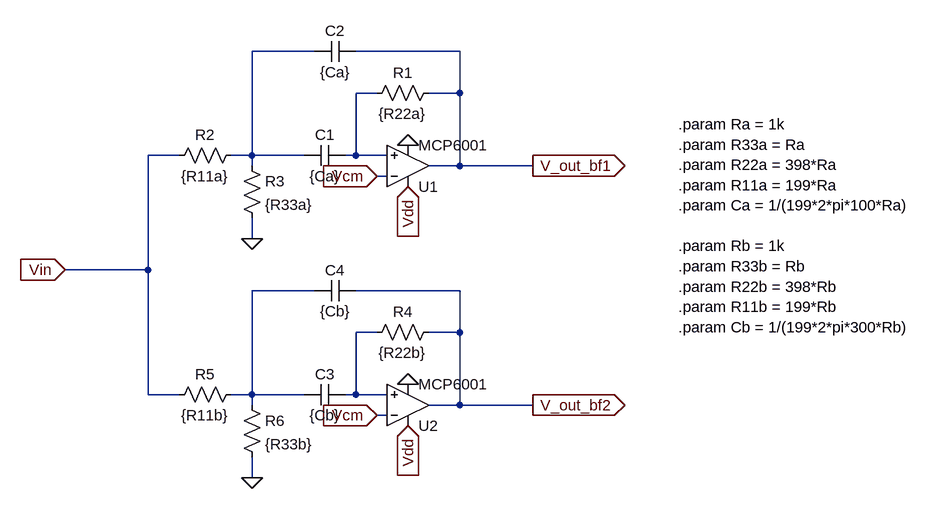
[diagram p0: schematic Draft21.asc]
Draft21.asc, the LTspice schematic file:
Version 4
SHEET 1 880 680
WIRE -64 -192 -160 -192
WIRE 160 -192 0 -192
WIRE 32 -128 0 -128
WIRE 160 -128 160 -192
WIRE 160 -128 112 -128
WIRE -272 -32 -320 -32
WIRE -160 -32 -160 -192
WIRE -160 -32 -192 -32
WIRE -80 -32 -160 -32
WIRE 0 -32 0 -128
WIRE 0 -32 -16 -32
WIRE 48 -32 0 -32
WIRE -160 -16 -160 -32
WIRE 160 -16 160 -128
WIRE 160 -16 112 -16
WIRE 272 -16 160 -16
WIRE 48 0 32 0
WIRE -160 96 -160 64
WIRE -320 144 -320 -32
WIRE -320 144 -448 144
WIRE -64 176 -160 176
WIRE 160 176 0 176
WIRE 32 240 0 240
WIRE 160 240 160 176
WIRE 160 240 112 240
WIRE -320 336 -320 144
WIRE -272 336 -320 336
WIRE -160 336 -160 176
WIRE -160 336 -192 336
WIRE -80 336 -160 336
WIRE 0 336 0 240
WIRE 0 336 -16 336
WIRE 48 336 0 336
WIRE -160 352 -160 336
WIRE 160 352 160 240
WIRE 160 352 112 352
WIRE 272 352 160 352
WIRE 48 368 32 368
WIRE -160 464 -160 432
FLAG 80 -48 0
FLAG 80 16 Vdd
IOPIN 80 16 In
FLAG -160 96 0
FLAG 80 320 0
FLAG 80 384 Vdd
IOPIN 80 384 In
FLAG -160 464 0
FLAG 272 -16 V_out_bf1
IOPIN 272 -16 Out
FLAG 272 352 V_out_bf2
IOPIN 272 352 Out
FLAG 32 368 Vcm
IOPIN 32 368 In
FLAG 32 0 Vcm
IOPIN 32 0 In
FLAG -448 144 Vin
IOPIN -448 144 In
SYMBOL MCP6001 80 -16 M180
SYMATTR InstName U1
SYMBOL cap -16 -16 M270
WINDOW 0 32 32 VTop 2
WINDOW 3 0 32 VBottom 2
SYMATTR InstName C1
SYMATTR Value {Ca}
SYMBOL cap 0 -176 M270
WINDOW 0 32 32 VTop 2
WINDOW 3 0 32 VBottom 2
SYMATTR InstName C2
SYMATTR Value {Ca}
SYMBOL res 128 -144 R90
WINDOW 0 0 56 VBottom 2
WINDOW 3 32 56 VTop 2
SYMATTR InstName R1
SYMATTR Value {R22a}
SYMBOL res -176 -48 R90
WINDOW 0 0 56 VBottom 2
WINDOW 3 32 56 VTop 2
SYMATTR InstName R2
SYMATTR Value {R11a}
SYMBOL res -176 -32 R0
SYMATTR InstName R3
SYMATTR Value {R33a}
SYMBOL MCP6001 80 352 M180
SYMATTR InstName U2
SYMBOL cap -16 352 M270
WINDOW 0 32 32 VTop 2
WINDOW 3 0 32 VBottom 2
SYMATTR InstName C3
SYMATTR Value {Cb}
SYMBOL cap 0 192 M270
WINDOW 0 32 32 VTop 2
WINDOW 3 0 32 VBottom 2
SYMATTR InstName C4
SYMATTR Value {Cb}
SYMBOL res 128 224 R90
WINDOW 0 0 56 VBottom 2
WINDOW 3 32 56 VTop 2
SYMATTR InstName R4
SYMATTR Value {R22b}
SYMBOL res -176 320 R90
WINDOW 0 0 56 VBottom 2
WINDOW 3 32 56 VTop 2
SYMATTR InstName R5
SYMATTR Value {R11b}
SYMBOL res -176 336 R0
SYMATTR InstName R6
SYMATTR Value {R33b}
TEXT 496 -80 Left 2 !.param Ra = 1k\n.param R33a = Ra\n.param R22a = 398*Ra\n.param R11a = 199*Ra\n.param Ca = 1/(199*2*pi*100*Ra)\n \n.param Rb = 1k\n.param R33b = Rb\n.param R22b = 398*Rb\n.param R11b = 199*Rb\n.param Cb = 1/(199*2*pi*300*Rb)

The netlist it stands for:
* Draft21.asc
* U1: MCP6001 (symbol MCP6001 not available, pins judged from their places): In+=N002 In-=Vcm V+=Vdd V-=0 OUT=V_out_bf1
C1 N002 N001 {Ca}
C2 V_out_bf1 N001 {Ca}
R1 V_out_bf1 N002 {R22a}
R2 N001 Vin {R11a}
R3 N001 0 {R33a}
* U2: MCP6001 (symbol MCP6001 not available, pins judged from their places): In+=N004 In-=Vcm V+=Vdd V-=0 OUT=V_out_bf2
C3 N004 N003 {Cb}
C4 V_out_bf2 N003 {Cb}
R4 V_out_bf2 N004 {R22b}
R5 N003 Vin {R11b}
R6 N003 0 {R33b}
.param Ra = 1k
.param R33a = Ra
.param R22a = 398*Ra
.param R11a = 199*Ra
.param Ca = 1/(199*2*pi*100*Ra)
.param Rb = 1k
.param R33b = Rb
.param R22b = 398*Rb
.param R11b = 199*Rb
.param Cb = 1/(199*2*pi*300*Rb)
.backanno
.end